# Altium project 2018-12-08_USB-RS485.PrjPcb
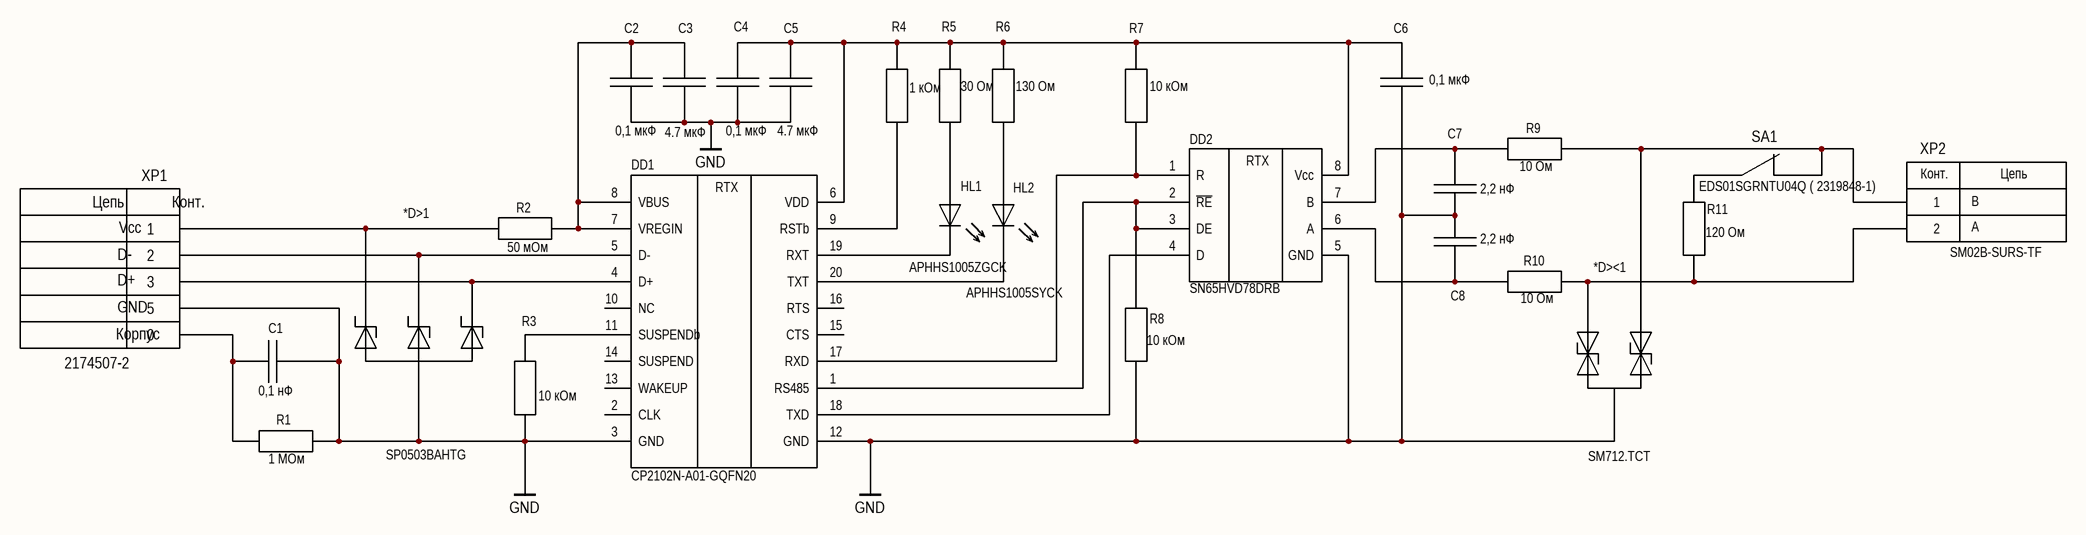
[diagram p0: Sheet1.SchDoc]
1 sheet, 28 parts. Net scope: global (net labels, ports and power ports of the same name join across sheets).
Board file: PCB1.PcbDoc

## Sheet Sheet1.SchDoc
size 420 x 297 mm; Scale: 1:1; DocumentType: Схема электрическая принципиальная; FirstReferrence: АБВГ.123456.001

### Parts
*D>1  (no value)  [SOT190P237X122-4N]
*D><1  (no value)  [SOT95P237X112-3L]
C1  Capacity: 0,1 нФ  [CAP0805]  (hidden comment: capasistor)
C2  Capacity: 0,1 мкФ  [CAP0402]  (hidden comment: capasistor)
C3  Capacity: 4.7 мкФ  [CAP0402]  (hidden comment: capasistor)
C4  Capacity: 0,1 мкФ  [CAP0402]  (hidden comment: capasistor)
C5  Capacity: 4.7 мкФ  [CAP0402]  (hidden comment: capasistor)
C6  Capacity: 0,1 мкФ  [CAP0402]  (hidden comment: capasistor)
C7  Capacity: 2,2 нФ  [CAP0402]  (hidden comment: capasistor)
C8  Capacity: 2,2 нФ  [CAP0402]  (hidden comment: capasistor)
DD1  CP2102N-A01-GQFN20  [QFN50P300X300X80_HS-17L]
DD2  SN65HVD78DRB  [SON65P300X100_HS-9L]
HL1  APHHS1005ZGCK  [LED0402]
HL2  APHHS1005SYCK  [LED0402]
R1  Resisrance: 1 МОм  [RES0402]  (hidden comment: resistor)
R2  Resisrance: 50 мОм  [RES0402]  (hidden comment: resistor)
R3  Resisrance: 10 кОм  [RES0402]  (hidden comment: resistor)
R4  Resisrance: 1 кОм  [RES0402]  (hidden comment: resistor)
R5  Resisrance: 30 Ом  [RES0402]  (hidden comment: resistor)
R6  Resisrance: 130 Ом  [RES0402]  (hidden comment: resistor)
R7  Resisrance: 10 кОм  [RES0402]  (hidden comment: resistor)
R8  Resisrance: 10 кОм  [RES0402]  (hidden comment: resistor)
R9  Resisrance: 10 Ом  [RES0402]  (hidden comment: resistor)
R10  Resisrance: 10 Ом  [RES0402]  (hidden comment: resistor)
R11  Resisrance: 120 Ом  [RES0402]  (hidden comment: resistor)
SA1  EDS01SGRNTU04Q ( 2319848-1)  [SWITCH_TE]
XP1  (no value)  [2174507-2]
XP2  PartNumber: SM02B-SURS-TF  [CONN_JST_SUH_02]  (hidden comment: connector)

### Nets
GND: *D>1.1(Catod) *D><1.3(Catod) C1.1 C2.1 C3.1 C4.1 C5.1 C6.1 C7.1 C8.2 DD1.3(GND) DD1.12(GND) DD2.5(GND) R1.1 R3.1 R8.1 XP1.5
Net*D>1_2: *D>1.2(Catod) R2.2 XP1.1
Net*D>1_3: *D>1.3(Catos) DD1.5(D-) XP1.2
Net*D>1_4: *D>1.4(Catos) DD1.4(D+) XP1.3
Net*D><1_1: *D><1.1(Catod) R10.1 R11.2 XP2.2
Net*D><1_2: *D><1.2(Catos) R9.1 SA1.2 XP2.1
NetC1_2: C1.2 R1.2 XP1.0
NetC2_2: C2.2 C3.2 DD1.7(VREGIN) DD1.8(VBUS) R2.1
NetC4_2: C4.2 C5.2 C6.2 DD1.6(VDD) DD2.8(Vcc) R4.2 R5.2 R6.2 R7.2
NetC7_2: C7.2 DD2.7(B) R9.2
NetC8_1: C8.1 DD2.6(A) R10.2
NetDD1_1: DD1.1(RS485) DD2.2(~{RE}) DD2.3(DE) R8.2
NetDD1_9: DD1.9(RSTb) R4.1
NetDD1_11: DD1.11(SUSPENDb) R3.2
NetDD1_17: DD1.17(RXD) DD2.1(R) R7.1
NetDD1_18: DD1.18(TXD) DD2.4(D)
NetDD1_19: DD1.19(RXT) HL1.1(K)
NetDD1_20: DD1.20(TXT) HL2.1(K)
NetHL1_2: HL1.2(A) R5.1
NetHL2_2: HL2.2(A) R6.1
NetR11_1: R11.1 SA1.1

Not connected (* = marked no-connect by the designer): DD1 2(CLK) 10(NC) 13(WAKEUP) 14(SUSPEND) 15(CTS) 16(RTS)

### Notes on the sheet
- B
- A
- Перв. примен.
- Справ. №
- Подп. и дата
- Инв. № дубл.
- Взам. инв. №
- Разраб.
- Изм.
- Лист
- № докум.
- Подп.
- Дата
- Лит.
- Масса
- Масштаб
- Пров.
- Т.контр.
- Листов
- Инв. № подл.
- Утв.
- Н.контр.
- 2.106-A3
- Копировал
- Формат А3
- (in symbol CONN_02P) Конт.; Цепь
- (in symbol CP2102N-A01-GQFN20) RTX
- (in symbol MICRO USB, TYPE B) Цепь; Конт.; Vcc; D-; D+; GND; Корпус
- (in symbol SN65HVD78DRB) RTX
- (in symbol RS485) Цепь; +5В; A; B; GND

### Library data of the parts
*D>1 = SP0503BAHTG: Unidirectional TVS Array; Manufacturer: Littelfuse; PowerDissipation: 600 Вт; Type1: Диод лавинный сборка; Family: Приборы полупроводниковые; PartNumber: SP0503BAHTG; Package/Case: sot-143; Package: sot-143
*D><1 = SM712.TCT: TVS Diode for RS-485; Manufacturer: Semtech; PowerDissipation: 600 Вт; Type1: Диод лавинный сборка; Family: Приборы полупроводниковые; PartNumber: SM712.TCT; Package/Case: sot-23-3; Package: sot-23-3
C1 = CAP: Manufacturer: Kemet; PartNumber: C0805C101MDRACTU; Tolerance: 20%; Voltage: 1 кВ; Package: 0805
C2 C4 C6 = CAP: Manufacturer: Murata; PartNumber: GRM033R61A104ME15D; Tolerance: 20%; Voltage: 10В; Package: 0402
C3 C5 = CAP: Manufacturer: Murata; PartNumber: GRM155R61A475MEAAD; Tolerance: 20%; Voltage: 10В; Package: 0402
C7 C8 = CAP: Manufacturer: Murata; PartNumber: GRM155R61A222KA01D; Tolerance: 10%; Voltage: 10В; Package: 0402
DD1 = CP2102N-A01-GQFN20: USB-to-UART bridge; Manufacturer: Silicon Laboratories; Type1: Преобразователь интерфейсный; PartNumber: CP2102N-A01-GQFN20; Package: QFN20; Family: Схемы интегральные
DD2 = SN65HVD78DRB: RS-485 With IEC ESD Protection; Manufacturer: Texas Instruments; Type1: Преобразователь интерфейсный; PartNumber: SN65HVD78DRB; Package: VSON8; Family: Схемы интегральные
HL1 = APHHS1005ZGCK: LED GREEN SMD 1.0X0.5MM; Manufacturer: Kingbright; Voltage(V): 2.7; Family: Устройства индикационные и сигнальные; PartNumber: APHHS1005ZGCK; ComponentLink1Description: Параметры; Package: 0402
HL2 = APHHS1005ZGCK: LED GREEN SMD 1.0X0.5MM; Manufacturer: Kingbright; Voltage(V): 3.0; Family: Устройства индикационные и сигнальные; PartNumber: APHHS1005SYCK; ComponentLink1Description: Параметры; Package: 0402
R1 = RES: PartNumber: RC0402JR-071ML; Manufacturer: Yageo; Tolerance: 5%; Package: 0402
R2 = RES: PartNumber: RL0402FR-070R05L; Manufacturer: Yageo; Tolerance: 1%; Package: 0402
R3 R7 R8 = RES: PartNumber: RC0402JR-0710KL; Manufacturer: Yageo; Tolerance: 5%; Package: 0402
R4 = RES: PartNumber: RC0402JR-071KL; Manufacturer: Yageo; Tolerance: 5%; Package: 0402
R5 = RES: PartNumber: RC0402JR-0730RL; Manufacturer: Yageo; Tolerance: 5%; Package: 0402
R6 = RES: PartNumber: RC0402JR-07130RL; Manufacturer: Yageo; Tolerance: 5%; Package: 0402
R9 R10 = RES: PartNumber: RC0402JR-0710RL; Manufacturer: Yageo; Tolerance: 5%; Package: 0402
R11 = RES: PartNumber: RC0402JR-07120RL; Manufacturer: Yageo; Tolerance: 5%; Package: 0402
SA1 = EDS01SGRNTU04Q: Dip-switch; Manufacturer: TE; Type1: Выключатель движковый модульный; Package: DIP; PartNumber: EDS01SGRNTU04Q ( 2319848-1); ComponentLink1URL: d:\WORK\Altium\Projects\2017-02-01_Prj\DataSheets\IT-1184 Series.pdf; Family: Устройства коммутационные в цепях управления, сигнализации и измерительных
XP1 = MICRO USB, TYPE B: Manufacturer: TE connectivity; Type1: Гнездо; Family: Соединения контактные; PartNumber: 2174507-2
XP2 = CONN_02P: 2 pin; Manufacturer: JST